# EAGLE schematic alpha (EAGLE 9.6.2)
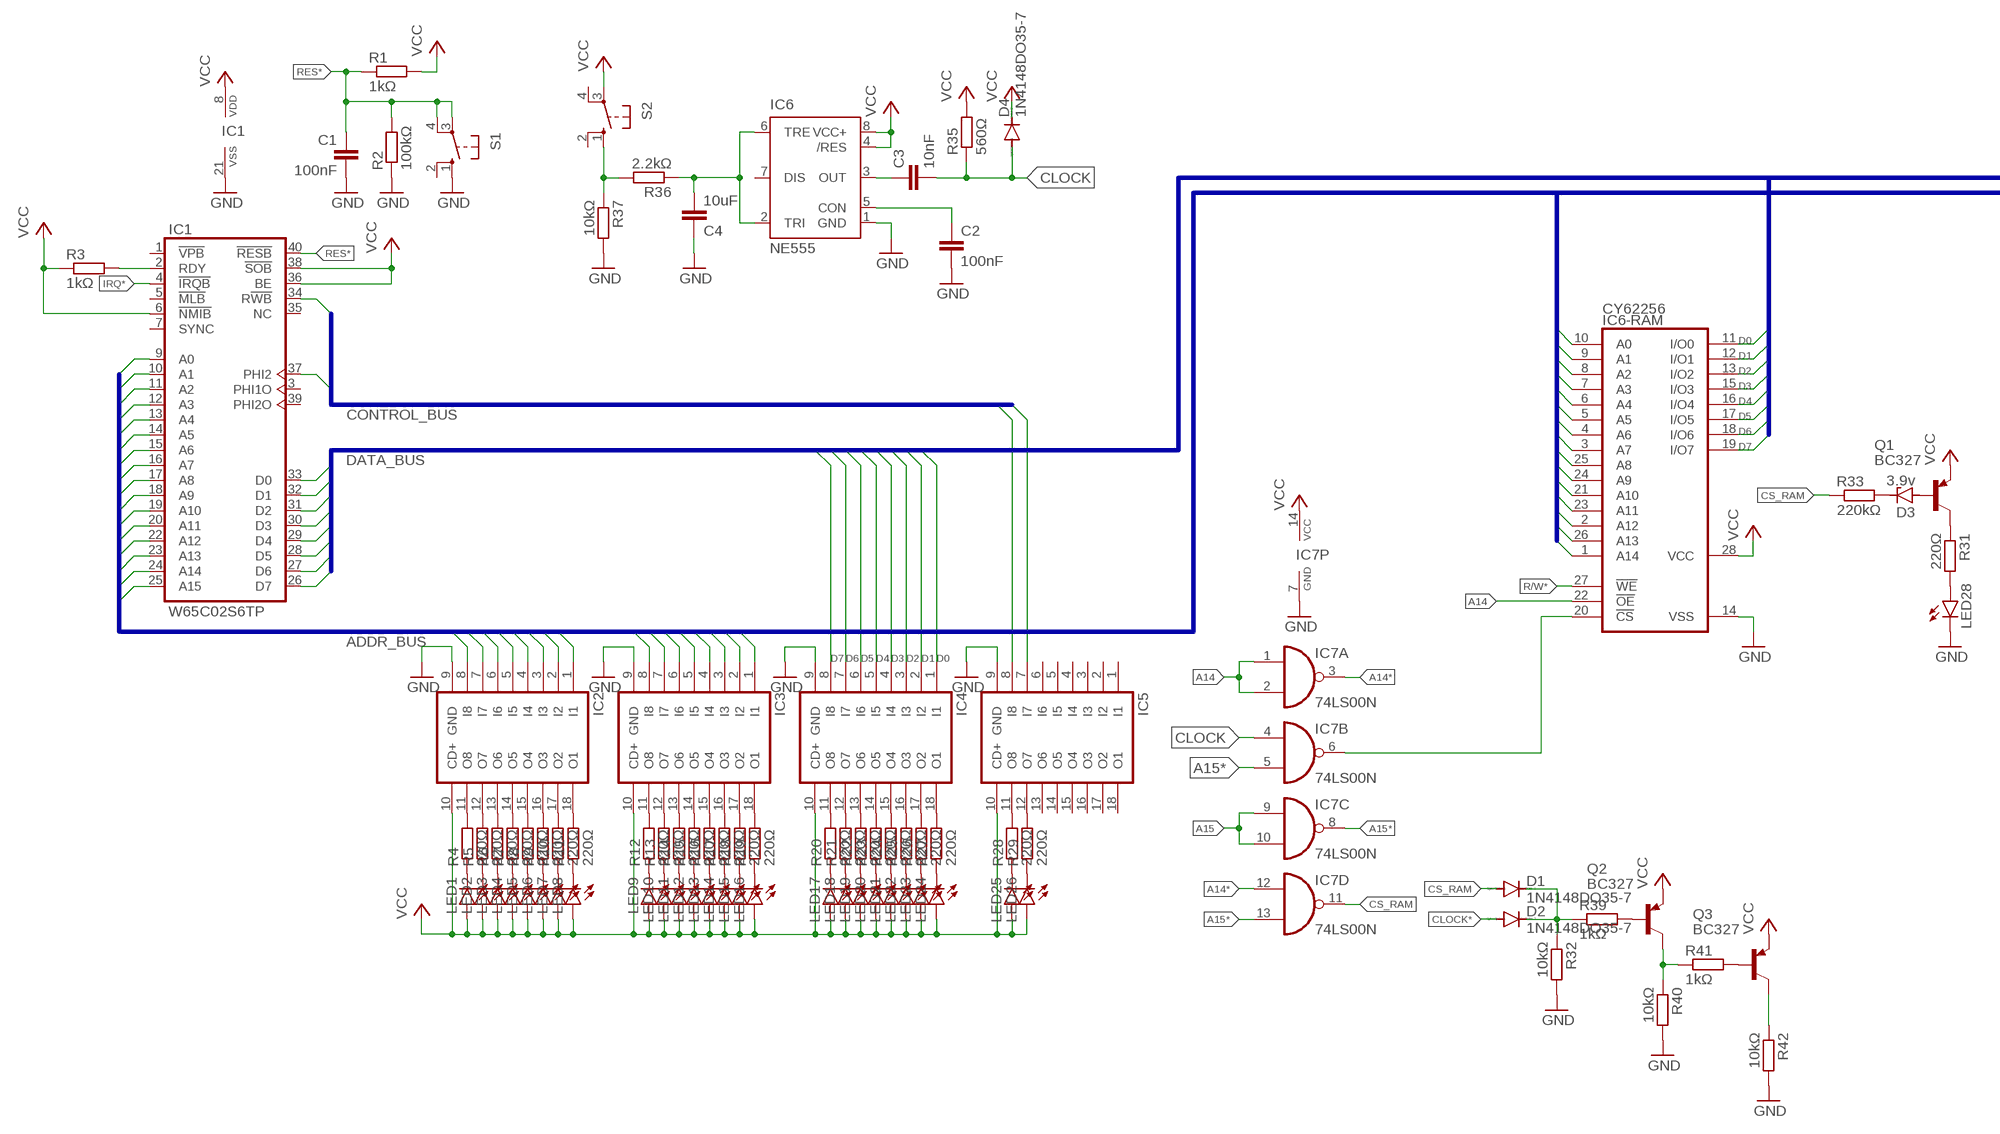
[diagram p0: schematic, sheet 1, part 1 of 2]
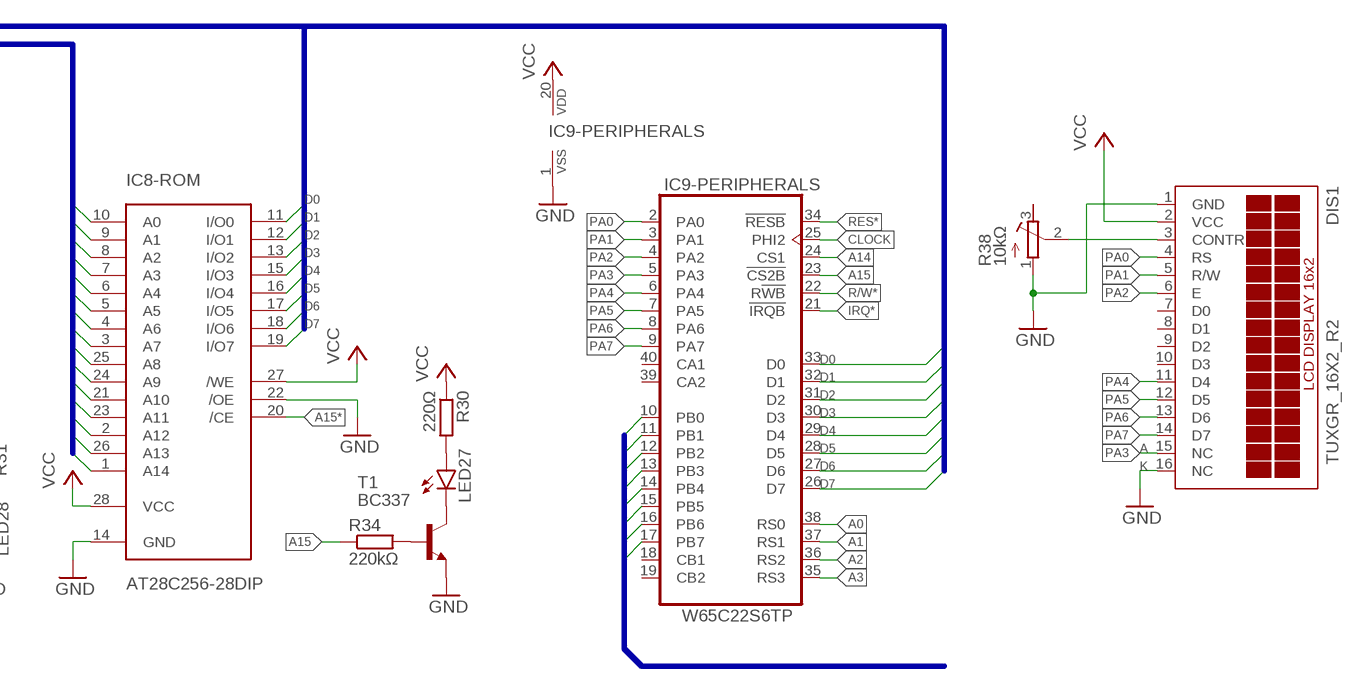
[diagram p1: schematic, sheet 1, part 2 of 2]

## Parts
C1  100nF  C-EU050-025X075  [C050-025X075]
C2  100nF  C-EU050-025X075  [C050-025X075]
C3  10nF  C-EU050-025X075  [C050-025X075]
C4  10uF  C-EU050-025X075  [C050-025X075]
D1  1N4148DO35-7  [DO35-7]
D2  1N4148DO35-7  [DO35-7]
D3  3.9v  ZENER-DIODEDO34-7  [DO34Z7]
D4  1N4148DO35-7  [DO35-7]
DIS1  TUXGR_16X2_R2  [TUXGR_16X2_R2]
IC1  W65C02S6TP  [DIL40]
IC2  ULN2803A  [DIL18]
IC3  ULN2803A  [DIL18]
IC4  ULN2803A  [DIL18]
IC5  ULN2803A  [DIL18]
IC6  NE555  [DIL-08]
IC6-RAM  62256P  [DIL28-6]
IC7  74LS00N  [DIL14]
IC8-ROM  AT28C256-28DIP  [DIL28-6]
IC9-PERIPHERALS  W65C22S6TP  [DIL40]
LED1  LED5MM  [LED5MM]
LED2  LED5MM  [LED5MM]
LED3  LED5MM  [LED5MM]
LED4  LED5MM  [LED5MM]
LED5  LED5MM  [LED5MM]
LED6  LED5MM  [LED5MM]
LED7  LED5MM  [LED5MM]
LED8  LED5MM  [LED5MM]
LED9  LED5MM  [LED5MM]
LED10  LED5MM  [LED5MM]
LED11  LED5MM  [LED5MM]
LED12  LED5MM  [LED5MM]
LED13  LED5MM  [LED5MM]
LED14  LED5MM  [LED5MM]
LED15  LED5MM  [LED5MM]
LED16  LED5MM  [LED5MM]
LED17  LED5MM  [LED5MM]
LED18  LED5MM  [LED5MM]
LED19  LED5MM  [LED5MM]
LED20  LED5MM  [LED5MM]
LED21  LED5MM  [LED5MM]
LED22  LED5MM  [LED5MM]
LED23  LED5MM  [LED5MM]
LED24  LED5MM  [LED5MM]
LED25  LED5MM  [LED5MM]
LED26  LED5MM  [LED5MM]
LED27  LED5MM  [LED5MM]
LED28  LED5MM  [LED5MM]
Q1  BC327  [TO92]
Q2  BC327  [TO92]
Q3  BC327  [TO92]
R1  1kΩ  R-EU_0207/10  [0207/10]
R2  100kΩ  R-EU_0207/10  [0207/10]
R3  1kΩ  R-EU_0207/10  [0207/10]
R4  220Ω  R-EU_0207/10  [0207/10]
R5  220Ω  R-EU_0207/10  [0207/10]
R6  220Ω  R-EU_0207/10  [0207/10]
R7  220Ω  R-EU_0207/10  [0207/10]
R8  220Ω  R-EU_0207/10  [0207/10]
R9  220Ω  R-EU_0207/10  [0207/10]
R10  220Ω  R-EU_0207/10  [0207/10]
R11  220Ω  R-EU_0207/10  [0207/10]
R12  220Ω  R-EU_0207/10  [0207/10]
R13  220Ω  R-EU_0207/10  [0207/10]
R14  220Ω  R-EU_0207/10  [0207/10]
R15  220Ω  R-EU_0207/10  [0207/10]
R16  220Ω  R-EU_0207/10  [0207/10]
R17  220Ω  R-EU_0207/10  [0207/10]
R18  220Ω  R-EU_0207/10  [0207/10]
R19  220Ω  R-EU_0207/10  [0207/10]
R20  220Ω  R-EU_0207/10  [0207/10]
R21  220Ω  R-EU_0207/10  [0207/10]
R22  220Ω  R-EU_0207/10  [0207/10]
R23  220Ω  R-EU_0207/10  [0207/10]
R24  220Ω  R-EU_0207/10  [0207/10]
R25  220Ω  R-EU_0207/10  [0207/10]
R26  220Ω  R-EU_0207/10  [0207/10]
R27  220Ω  R-EU_0207/10  [0207/10]
R28  220Ω  R-EU_0207/10  [0207/10]
R29  220Ω  R-EU_0207/10  [0207/10]
R30  220Ω  R-EU_0207/10  [0207/10]
R31  220Ω  R-EU_0207/10  [0207/10]
R32  10kΩ  R-EU_0207/10  [0207/10]
R33  220kΩ  R-EU_0207/10  [0207/10]
R34  220kΩ  R-EU_0207/10  [0207/10]
R35  560Ω  R-EU_0207/10  [0207/10]
R36  2.2kΩ  R-EU_0207/10  [0207/10]
R37  10kΩ  R-EU_0207/10  [0207/10]
R38  10kΩ  R-TRIMM64W  [RTRIM64W]
R39  1kΩ  R-EU_0207/10  [0207/10]
R40  10kΩ  R-EU_0207/10  [0207/10]
R41  1kΩ  R-EU_0207/10  [0207/10]
R42  10kΩ  R-EU_0207/10  [0207/10]
S1  10-XX  [B3F-10XX]
S2  10-XX  [B3F-10XX]
T1  BC337  [TO92]

## Nets
A0: IC1.9(1:A0) IC3.1(I1) IC6-RAM.10(A0) IC8-ROM.10(A0) IC9-PERIPHERALS.38(VIA:RS0)
A1: IC1.10(1:A1) IC3.2(I2) IC6-RAM.9(A1) IC8-ROM.9(A1) IC9-PERIPHERALS.37(VIA:RS1)
A2: IC1.11(1:A2) IC3.3(I3) IC6-RAM.8(A2) IC8-ROM.8(A2) IC9-PERIPHERALS.36(VIA:RS2)
A3: IC1.12(1:A3) IC3.4(I4) IC6-RAM.7(A3) IC8-ROM.7(A3) IC9-PERIPHERALS.35(VIA:RS3)
A4: IC1.13(1:A4) IC3.5(I5) IC6-RAM.6(A4) IC8-ROM.6(A4)
A5: IC1.14(1:A5) IC3.6(I6) IC6-RAM.5(A5) IC8-ROM.5(A5)
A6: IC1.15(1:A6) IC3.7(I7) IC6-RAM.4(A6) IC8-ROM.4(A6)
A7: IC1.16(1:A7) IC3.8(I8) IC6-RAM.3(A7) IC8-ROM.3(A7)
A8: IC1.17(1:A8) IC2.1(I1) IC6-RAM.25(A8) IC8-ROM.25(A8)
A9: IC1.18(1:A9) IC2.2(I2) IC6-RAM.24(A9) IC8-ROM.24(A9)
A10: IC1.19(1:A10) IC2.3(I3) IC6-RAM.21(A10) IC8-ROM.21(A10)
A11: IC1.20(1:A11) IC2.4(I4) IC6-RAM.23(A11) IC8-ROM.23(A11)
A12: IC1.22(1:A12) IC2.5(I5) IC6-RAM.2(A12) IC8-ROM.2(A12)
A13: IC1.23(1:A13) IC2.6(I6) IC6-RAM.26(A13) IC8-ROM.26(A13)
A14: IC1.24(1:A14) IC2.7(I7) IC6-RAM.1(A14) IC6-RAM.22(!OE) IC7.1(A:I0) IC7.2(A:I1) IC8-ROM.1(A14) IC9-PERIPHERALS.24(VIA:CS1)
A14*: IC7.3(A:O) IC7.12(D:I0)
A15: IC1.25(1:A15) IC2.8(I8) IC7.9(C:I0) IC7.10(C:I1) IC9-PERIPHERALS.23(VIA:!CS2B) R34.1
A15*: IC7.5(B:I1) IC7.8(C:O) IC7.13(D:I1) IC8-ROM.20(/CE)
CLOCK: C3.2 D4.A IC1.37(1:PHI2) IC5.8(I8) IC7.4(B:I0) IC9-PERIPHERALS.25(VIA:PHI2) R35.1
CLOCK*: D2.A
CS_RAM: D1.A IC7.11(D:O) R33.1
D0: IC1.33(1:D0) IC4.1(I1) IC6-RAM.11(I/O0) IC8-ROM.11(I/O0) IC9-PERIPHERALS.33(VIA:D0)
D1: IC1.32(1:D1) IC4.2(I2) IC6-RAM.12(I/O1) IC8-ROM.12(I/O1) IC9-PERIPHERALS.32(VIA:D1)
D2: IC1.31(1:D2) IC4.3(I3) IC6-RAM.13(I/O2) IC8-ROM.13(I/O2) IC9-PERIPHERALS.31(VIA:D2)
D3: IC1.30(1:D3) IC4.4(I4) IC6-RAM.15(I/O3) IC8-ROM.15(I/O3) IC9-PERIPHERALS.30(VIA:D3)
D4: IC1.29(1:D4) IC4.5(I5) IC6-RAM.16(I/O4) IC8-ROM.16(I/O4) IC9-PERIPHERALS.29(VIA:D4)
D5: IC1.28(1:D5) IC4.6(I6) IC6-RAM.17(I/O5) IC8-ROM.17(I/O5) IC9-PERIPHERALS.28(VIA:D5)
D6: IC1.27(1:D6) IC4.7(I7) IC6-RAM.18(I/O6) IC8-ROM.18(I/O6) IC9-PERIPHERALS.27(VIA:D6)
D7: IC1.26(1:D7) IC4.8(I8) IC6-RAM.19(I/O7) IC8-ROM.19(I/O7) IC9-PERIPHERALS.26(VIA:D7)
GND: C1.2 C2.2 C4.1 DIS1.1(GND) DIS1.16(NC) IC1.21(P:VSS) IC2.9(GND) IC3.9(GND) IC4.9(GND) IC5.9(GND) IC6-RAM.14(VSS) IC6.1(GND) IC7.7(P:GND) IC8-ROM.14(GND) IC8-ROM.22(/OE) IC9-PERIPHERALS.1(VIAP:VSS) LED28.K(C) R2.1 R32.2 R37.2 R38.1(A) R40.2 R42.2 S1.1(S) T1.1(E)
IRQ*: IC1.4(1:!IRQB) IC9-PERIPHERALS.21(VIA:!IRQB)
N$1: IC1.2(1:RDY) R3.2
N$2: LED1.K(C) R4.1
N$3: LED2.K(C) R5.1
N$4: LED3.K(C) R6.1
N$5: LED4.K(C) R7.1
N$6: LED5.K(C) R8.1
N$7: LED6.K(C) R9.1
N$8: LED7.K(C) R10.1
N$9: LED8.K(C) R11.1
N$10: LED9.K(C) R12.1
N$11: LED10.K(C) R13.1
N$12: LED11.K(C) R14.1
N$13: LED12.K(C) R15.1
N$14: LED13.K(C) R16.1
N$15: LED14.K(C) R17.1
N$16: LED15.K(C) R18.1
N$17: LED16.K(C) R19.1
N$18: LED17.K(C) R20.1
N$19: LED18.K(C) R21.1
N$20: LED19.K(C) R22.1
N$21: LED20.K(C) R23.1
N$22: LED21.K(C) R24.1
N$23: LED22.K(C) R25.1
N$24: LED23.K(C) R26.1
N$25: LED24.K(C) R27.1
N$26: LED25.K(C) R28.1
N$27: LED26.K(C) R29.1
N$28: IC2.11(O8) R4.2
N$29: IC2.12(O7) R5.2
N$30: IC2.13(O6) R6.2
N$31: IC2.14(O5) R7.2
N$32: IC2.15(O4) R8.2
N$33: IC2.16(O3) R9.2
N$34: IC2.17(O2) R10.2
N$35: IC2.18(O1) R11.2
N$36: IC3.11(O8) R12.2
N$37: IC3.12(O7) R13.2
N$38: IC3.13(O6) R14.2
N$39: IC3.14(O5) R15.2
N$40: IC3.15(O4) R16.2
N$41: IC3.16(O3) R17.2
N$42: IC3.17(O2) R18.2
N$43: IC3.18(O1) R19.2
N$44: IC4.11(O8) R20.2
N$45: IC4.12(O7) R21.2
N$46: IC4.13(O6) R22.2
N$47: IC4.14(O5) R23.2
N$48: IC4.15(O4) R24.2
N$49: IC4.16(O3) R25.2
N$50: IC4.17(O2) R26.2
N$51: IC4.18(O1) R27.2
N$52: IC5.11(O8) R28.2
N$53: IC5.12(O7) R29.2
N$54: LED27.A R30.2
N$55: Q1.3(C) R31.1
N$56: LED28.A R31.2
N$57: D1.C D2.C R32.1 R39.1
N$58: LED27.K(C) T1.3(C)
N$59: D3.A Q1.2(B)
N$60: R34.2 T1.2(B)
N$61: D3.C R33.2
N$62: C3.1 IC6.3(OUT)
N$63: C4.2 IC6.2(TRI) IC6.6(TRE) R36.1
N$64: C2.1 IC6.5(CON)
N$65: R36.2 R37.1 S2.1(S)
N$66: DIS1.3(CONTR) R38.2(S)
N$67: IC6-RAM.20(!CS) IC7.6(B:O)
N$68: Q2.2(B) R39.2
N$69: Q2.3(C) R40.1 R41.1
N$70: Q3.2(B) R41.2
N$71: Q3.3(C) R42.1
PA0: DIS1.4(RS) IC9-PERIPHERALS.2(VIA:PA0)
PA1: DIS1.5(R/W) IC9-PERIPHERALS.3(VIA:PA1)
PA2: DIS1.6(E) IC9-PERIPHERALS.4(VIA:PA2)
PA3: DIS1.15(NC) IC9-PERIPHERALS.5(VIA:PA3)
PA4: DIS1.11(D4) IC9-PERIPHERALS.6(VIA:PA4)
PA5: DIS1.12(D5) IC9-PERIPHERALS.7(VIA:PA5)
PA6: DIS1.13(D6) IC9-PERIPHERALS.8(VIA:PA6)
PA7: DIS1.14(D7) IC9-PERIPHERALS.9(VIA:PA7)
PB0: IC9-PERIPHERALS.10(VIA:PB0)
PB1: IC9-PERIPHERALS.11(VIA:PB1)
PB2: IC9-PERIPHERALS.12(VIA:PB2)
PB3: IC9-PERIPHERALS.13(VIA:PB3)
PB4: IC9-PERIPHERALS.14(VIA:PB4)
PB5: IC9-PERIPHERALS.15(VIA:PB5)
PB6: IC9-PERIPHERALS.16(VIA:PB6)
PB7: IC9-PERIPHERALS.17(VIA:PB7)
R/W*: IC1.34(1:R!WB) IC5.7(I7) IC6-RAM.27(!WE) IC9-PERIPHERALS.22(VIA:R!WB)
RES*: C1.1 IC1.40(1:!RESB) IC9-PERIPHERALS.34(VIA:!RESB) R1.1 R2.2 S1.3(P) S1.4(P1)
VCC: D4.C DIS1.2(VCC) IC1.6(1:!NMIB) IC1.8(P:VDD) IC1.36(1:BE) IC1.38(1:!SOB) IC2.10(CD+) IC3.10(CD+) IC4.10(CD+) IC5.10(CD+) IC6-RAM.28(VCC) IC6.4(/RES) IC6.8(VCC+) IC7.14(P:VCC) IC8-ROM.27(/WE) IC8-ROM.28(VCC) IC9-PERIPHERALS.20(VIAP:VDD) LED1.A LED2.A LED3.A LED4.A LED5.A LED6.A LED7.A LED8.A LED9.A LED10.A LED11.A LED12.A LED13.A LED14.A LED15.A LED16.A LED17.A LED18.A LED19.A LED20.A LED21.A LED22.A LED23.A LED24.A LED25.A LED26.A Q1.1(E) Q2.1(E) Q3.1(E) R1.2 R3.1 R30.1 R35.2 S2.3(P)
Unconnected: DIS1.7(D0) DIS1.8(D1) DIS1.9(D2) DIS1.10(D3) IC1.1(1:!VPB) IC1.3(1:PHI1O) IC1.5(1:!MLB) IC1.7(1:SYNC) IC1.35(1:NC) IC1.39(1:PHI2O) IC5.1(I1) IC5.2(I2) IC5.3(I3) IC5.4(I4) IC5.5(I5) IC5.6(I6) IC5.13(O6) IC5.14(O5) IC5.15(O4) IC5.16(O3) IC5.17(O2) IC5.18(O1) IC6.7(DIS) IC9-PERIPHERALS.18(VIA:CB1) IC9-PERIPHERALS.19(VIA:CB2) IC9-PERIPHERALS.39(VIA:CA2) IC9-PERIPHERALS.40(VIA:CA1) R38.3(E) S1.2(S1) S2.2(S1) S2.4(P1)

## Buses
D0,D1,D2,D3,D4,D5,D6,D7
ADDR_BUS:A0,A1,A2,A3,A4,A5,A6,A7,A8,A9,A10,A11,A12,A13,A14,A15
CLOCK,R/W*
PORTB:PB0,PB1,PB2,PB3,PB4,PB5,PB6,PB7

## Notes on the sheet
- CY62256
- CONTROL_BUS
- DATA_BUS
- A
- K
- ADDR_BUS

## Library data of the parts
C1-C4 = rcl:C-EU: CAPACITOR, European symbol; SPICEPREFIX: C
D1 D2 D4 = diode:1N4148: DIODE high speed (Philips)
D3 = diode:ZENER-DIODE: Z-Diode
DIS1 = display-lcd:TUXGR_16X2_R2: Tuxgraphics LCD display 16x2 characters reflective, without background light Source: tuxgr_12x2_r2.pdf; OC_FARNELL: unknown; OC_NEWARK: unknown
IC1 = 6502:W65C02S: W65C02 by WDC
IC2-IC5 = uln-udn:ULN2803A: DRIVER ARRAY
IC6 = st-microelectronics:NE555: General purpose bipolar Timer; MF: Arrow Electronics; MPN: NE555N; OC_FARNELL: 1467742; OC_NEWARK: 89K1486
IC6-RAM = memory-hitachi:62256P: MEMORY; OC_FARNELL: unknown; OC_NEWARK: unknown
IC7 = 74xx-eu:74*00: Quad 2-input NAND gate
IC8-ROM = atmel-custom:AT28C256-28DIP: IC EEPROM 256KBIT 150NS 28DIP
IC9-PERIPHERALS = 6502:W65C22S: W65C22 by WDC
LED1-LED28 = led:LED: LED OSRAM: - CHIPLED LG R971, LG N971, LY N971, LG Q971, LY Q971, LO R971, LY R971 LH N974, LH R974 LS Q976, LO Q976, LY Q976 LO Q996 - Hyper CHIPLED LW Q18S LB Q993, LB Q99A, LB R99A - SideLED LS A670, LO A670, LY A670, LG A670, LP A670 LB A673, LV A673, LT A673, LW A673 LH A674 LY A675 LS A676, LA A676, LO A676, LY A676, LW A676 LS A679, LY A679, LG A679 - Hyper Micro SIDELED® LS Y876, LA Y876, LO Y876, LY Y876 LT Y87S - SmartLED LW L88C, LW L88S LB L89C, LB L89S, LG L890 LS L89K, LO L89K, LY L89K LS L896, LA L896, LO L896, LY L896 - TOPLED LS T670, LO T670, LY T670, LG T670, LP T670 LSG T670, LSP T670, LSY T670, LOP T670, LYG T670 LG T671, LOG T671, LSG T671 LB T673, LV T673, LT T673, LW T673 LH T674 LS T676, LA T676, LO T676, LY T676, LB T676, LH T676, LSB T676, LW T676 LB T67C, LV T67C, LT T67C, LS T67K, LO T67K, LY T67K, LW E67C LS E67B, LA E67B, LO E67B, LY E67B, LB E67C, LV E67C, LT E67C LW T67C LS T679, LY T679, LG T679 LS T770, LO T770, LY T770, LG T770, LP T770 LB T773, LV T773, LT T773, LW T773 LH T774 LS E675, LA E675, LY E675, LS T675 LS T776, LA T776, LO T776, LY T776, LB T776 LHGB T686 LT T68C, LB T68C - Hyper Mini TOPLED® LB M676 - Mini TOPLED Santana® LG M470 LS M47K, LO M47K, LY M47K Source: http://www.osram.convergy.de LUXEON: - LUMILED® LXK2-PW12-R00, LXK2-PW12-S00, LXK2-PW14-U00, LXK2-PW14-V00 LXK2-PM12-R00, LXK2-PM12-S00, LXK2-PM14-U00 LXK2-PE12-Q00, LXK2-PE12-R00, LXK2-PE12-S00, LXK2-PE14-T00, LXK2-PE14-U00 LXK2-PB12-K00, LXK2-PB12-L00, LXK2-PB12-M00, LXK2-PB14-N00, LXK2-PB14-P00, LXK2-PB14-Q00 LXK2-PR12-L00, LXK2-PR12-M00, LXK2-PR14-Q00, LXK2-PR14-R00 LXK2-PD12-Q00, LXK2-PD12-R00, LXK2-PD12-S00 LXK2-PH12-R00, LXK2-PH12-S00 LXK2-PL12-P00, LXK2-PL12-Q00, LXK2-PL12-R00 Source: www.luxeon.com KINGBRIGHT: KA-3528ASYC Source: www.kingbright.com
Q1-Q3 = transistor-pnp:BC327: PNP Transistor
R1-R37 R39-R42 = rcl:R-EU_: RESISTOR, European symbol; SPICEPREFIX: R
R38 = rcl:R-TRIMM: Trimm resistor; SPICEMODEL: X; SPICEPREFIXL: POT
S1 S2 = switch-omron:10-XX: OMRON SWITCH; MPN: B3F-1000; OC_FARNELL: 176432; OC_NEWARK: 36M3542
T1 = transistor:BC337: NPN TRANSISTOR